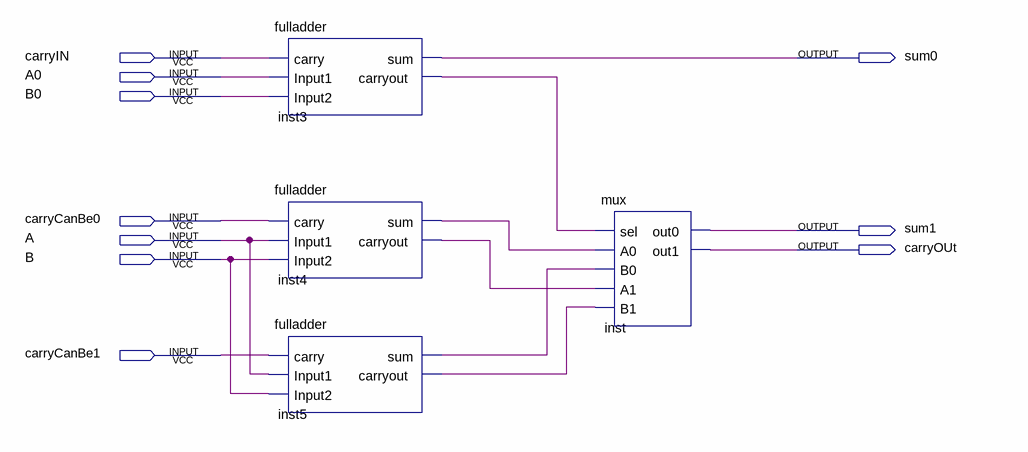
[diagram p0: schematic sheet]
// Quartus schematic sumAdder.bdf as structural Verilog: 4 symbols, 10 pins
module sumAdder (
  input  carryIN,
  input  A0,
  input  B0,
  input  carryCanBe0,
  input  A,
  input  B,
  input  carryCanBe1,
  output sum0,
  output sum1,
  output carryOUt
);

  wire inst3_carryout, inst4_carryout, inst4_sum, inst5_carryout, inst5_sum;

  fulladder inst3 (.carry(carryIN), .Input1(A0), .Input2(B0), .sum(sum0), .carryout(inst3_carryout));
  fulladder inst4 (.carry(carryCanBe0), .Input1(A), .Input2(B), .sum(inst4_sum), .carryout(inst4_carryout));
  fulladder inst5 (.carry(carryCanBe1), .Input1(A), .Input2(B), .sum(inst5_sum), .carryout(inst5_carryout));
  mux inst (
    .sel(inst3_carryout), .A0(inst4_sum), .B0(inst5_sum), .A1(inst4_carryout), .B1(inst5_carryout),
    .out0(sum1), .out1(carryOUt));
endmodule
